# Altium schematic sheet ac-dc-converter-hw.SchDoc
size A4; SheetNumber: 1; SheetTotal: 1
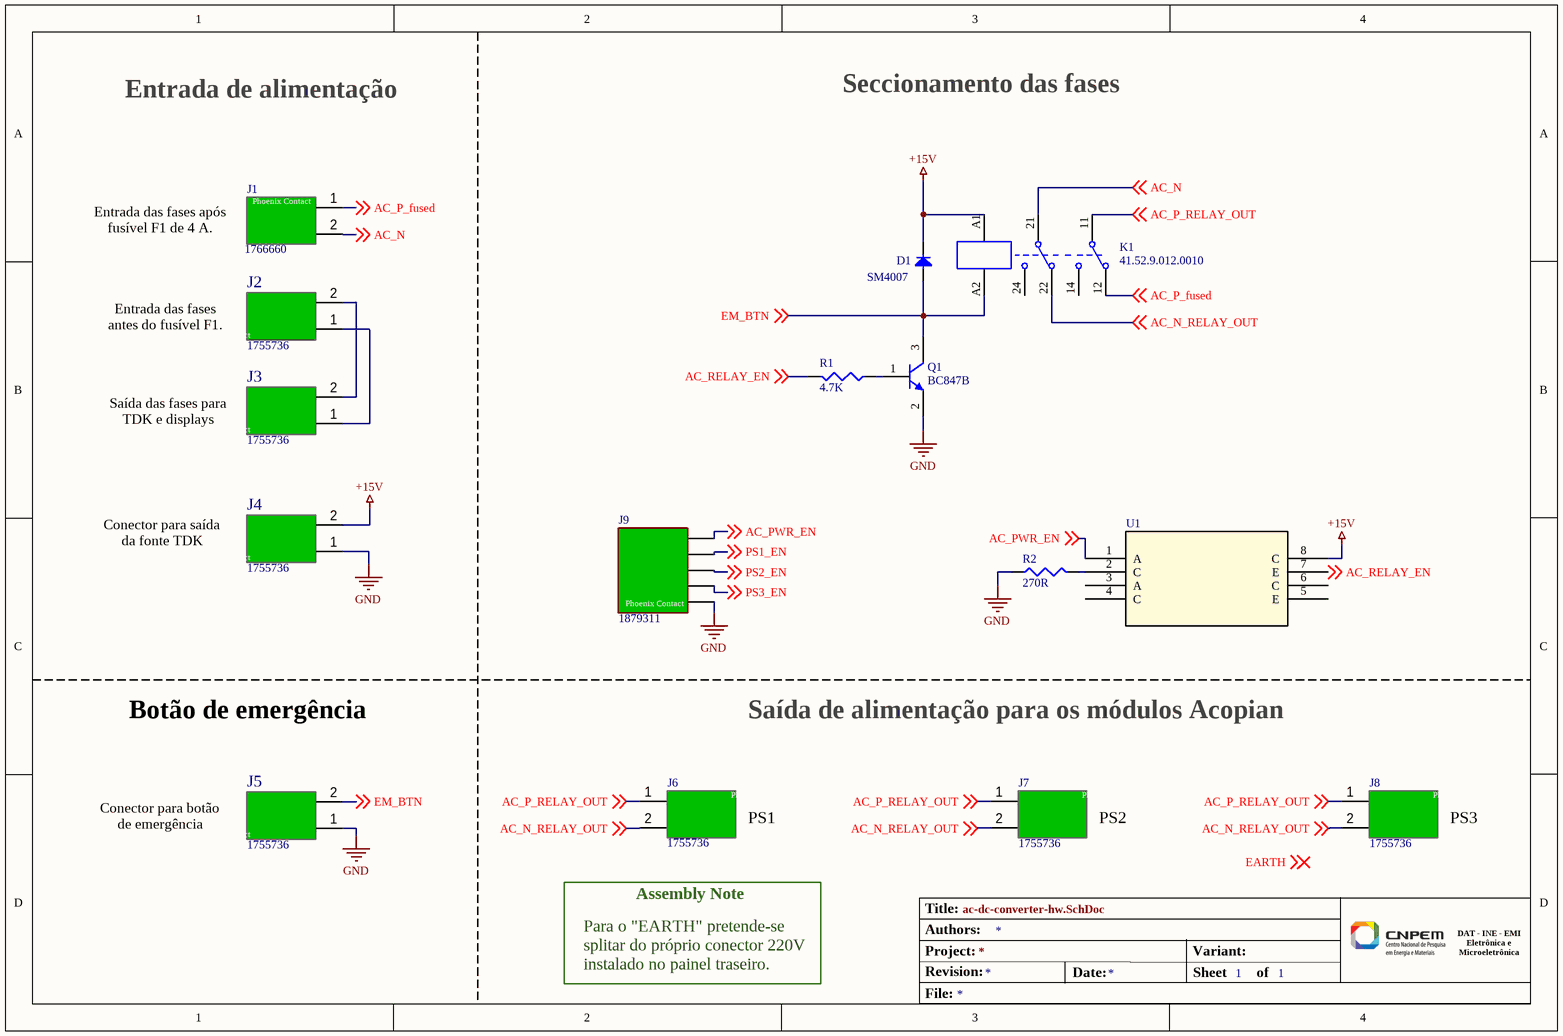
[diagram p0: ac-dc-converter-hw.SchDoc]

## Parts
D1  SM4007  [SM4007]
J1  1766660  [Conector 2 vias espaÃ§ado]
J2  1755736  [Conector 2 vias]
J3  1755736  [Conector 2 vias]
J4  1755736  [Conector 2 vias]
J5  1755736  [Conector 2 vias]
J6  1755736  [Conector 2 vias]
J7  1755736  [Conector 2 vias]
J8  1755736  [Conector 2 vias]
J9  1879311  [Conector Phoenix 5 vias 1879311]
K1  41.52.9.012.0010  [41.52.9.005.0010]
Q1  BC847B  [INF-SOT23_L]
R1  4.7K  [R0603]  (mechanical)
R2  270R  [R0603]
U1  (no value)  [SO-8_ILD]

## Nets
+15V: D1.1 J4.2 K1.A1 U1.8(C)
GND: J4.1 J5.1 J9.5 Q1.2(E) R2.1
AC_N: J1.2 K1.21 ; off-sheet AC_N
AC_N_RELAY_OUT: J6.2 J7.2 J8.2 K1.22 ; off-sheet AC_N_RELAY_OUT
AC_P_fused: J1.1 K1.12 ; off-sheet AC_P_fused
AC_P_RELAY_OUT: J6.1 J7.1 J8.1 K1.11 ; off-sheet AC_P_RELAY_OUT
AC_PWR_EN: J9.1 U1.1(A) ; off-sheet AC_PWR_EN
AC_RELAY_EN: R1.2 U1.7(E) ; off-sheet AC_RELAY_EN
EM_BTN: D1.2 J5.2 K1.A2 Q1.3(C) ; off-sheet EM_BTN
PS1_EN: J9.2 ; off-sheet PS1_EN
PS2_EN: J9.3 ; off-sheet PS2_EN
PS3_EN: J9.4 ; off-sheet PS3_EN
NetJ2_1: J2.1 J3.1
NetJ2_2: J2.2 J3.2
NetQ1_1: Q1.1(B) R1.1
NetR2_2: R2.2 U1.2(C)

Not connected (* = marked no-connect by the designer): K1 14 24; U1 3(A) 4(C) 5(E) 6(C)

## Notes on the sheet
- Entrada de alimentação
- Seccionamento das fases
- Entrada das fases após fusível F1 de 4 A.
- Entrada das fases antes do fusível F1.
- Saída das fases para TDK e displays
- Conector para saída da fonte TDK
- Botão de emergência
- Saída de alimentação para os módulos Acopian
- Conector para botão de emergência
- PS1
- PS2
- PS3
- Assembly Note
- Para o "EARTH" pretende-se splitar do próprio conector 220V instalado no painel traseiro.
- Labels drawn without touching a wire or pin: EARTH
- Authors:
- Title:
- Revision:
- File:
- Project:
- Date:
- Variant:
- Sheet
- of
- DAT - INE - EMI
  Eletrônica e
  Microeletrônica
- (in symbol Conector Phoenix 2 vias) Phoenix Contact
- (in symbol Conector Phoenix 2 vias_espaçado) Phoenix Contact
- (in symbol CONECTOR PHOENIX 5 VIAS 1879311) Phoenix Contact

## Library data of the parts
J1 = Conector Phoenix 2 vias_espaçado: Pitch 7.5mm
J2-J8 = Conector Phoenix 2 vias
J9 = CONECTOR PHOENIX 5 VIAS 1879311: Código LNLS: AP102667; ComponentLink1Description: https://www.onlinecomponents.com/en/datasheet/emcv155gf381-48817554/; ComponentLink1URL: https://www.onlinecomponents.com/en/datasheet/emcv155gf381-48817554/
K1 = 41.52.9.012.0010: Low Profile PCB Relay, 2 CO DPDT, 8A, Coil: 12VDC
Q1 = CMP-1177-00042-1: NPN Silicon AF Transistor, 45 V VCEO, 100 mA IC, SOT23, Reel, Green; Manufacturer: Infineon; VEBO (max): 6Â V; ICBO (max): 15Â nA; VCBO (max): 50Â V; IBM (max): 200Â mA; Green: TRUE; Ptot (max): 330Â mW; fT (typ): 250Â MHz; IC (max): 100Â mA; VCEO (max): 45Â V; PackageDescription: 3-Pin Small Outline Transistor Package, 1.3 x 2.9 mm Body, 0.95 mm Pitch; ComponentLink3URL: http://www.infineon.com/dgdl/SOT23-Package_Overview.pdf?folderId=db3a30431936bc4b0119532290053c66&fileId=db3a30431936bc4b0119533468123c85; PackageVersion: Apr-08; Packing: Reel; ComponentLink3Description: Package Specification; ComponentLink2URL: http://www.infineon.com/dgdl/bc847series_bc848series_bc849series_bc850series.pdf?folderId=db3a304314dca389011541d30fa21656&fileId=db3a304314dca389011541d4630a1657; ComponentLink1URL: http://www.infineon.com/; ComponentLink2Description: Datasheet; Polarity: NPN; Mounting Technology: Surface Mount; PackageReference: SOT23; ICM (max): 200Â mA; ComponentLink1Description: Manufacturer URL; PartNumber: BC847B
R1 = Resistor Generic: MCT06030C4701FP500
R2 = RESISTOR 270R: Resistor SMD 270 OHM 1% 1/10W 0603; Manufacturer 1: Vishay Dale; Manufacturer Part Number 1: CRCW0603270RFKEAC; Description 1: Res Thick Film 0603 270 Ohm 1% 0.1W(1/10W) ±100ppm/C Pad SMD T/R; Category 1: Chip SMD Resistors; Max Power Dissipation: 100mW; Temperature Coefficient: 100ppm/°C; Código LNLS: AP100898; Supplier 1: Mouser; Supplier Part Number 1: 71-CRCW0603270RFKEAC; RoHS 1: Yes; Stock 1: 68500; Pricing 1: 1=0,1, 10=0,016, 50=0,016, 100=0,009, 1000=0,006, 10000=0,004 (USD); Case/Package: 0603; Min Operating Temperature: -55°C; Max Operating Temperature: 155°C; Packaging: Tape and Reel; Resistance: 270R; Tolerance: 1%; Number of Terminations: 2; Series: CRCW-C; RoHS Compliant: Yes; ComponentLink1URL: http://www.vishay.com/docs/28773/crcwce3.pdf?src-supplier=Digi-Key; ComponentLink1Description: http://www.vishay.com/docs/28773/crcwce3.pdf?src-supplier=Digi-Key; ComponentLink2URL: https://datasheet.octopart.com/CRCW0603270RFKEAC-Vishay-datasheet-102570912.pdf?src-supplier=Future+Electronics; ComponentLink2Description: https://datasheet.octopart.com/CRCW0603270RFKEAC-Vishay-datasheet-102570912.pdf?src-supplier=Future+Electronics
U1 = ILD217T: No Description Available; Mfr_Name: Vishay; RefDes: RefDes; Type: Type